# Altium schematic sheet Morpheus_bottom.SchDoc: Morpheus_bottom
size Letter; DrawnBy: D. Fusi; DocumentNumber: 3; Revision: PVT; SheetNumber: 3; SheetTotal: 3
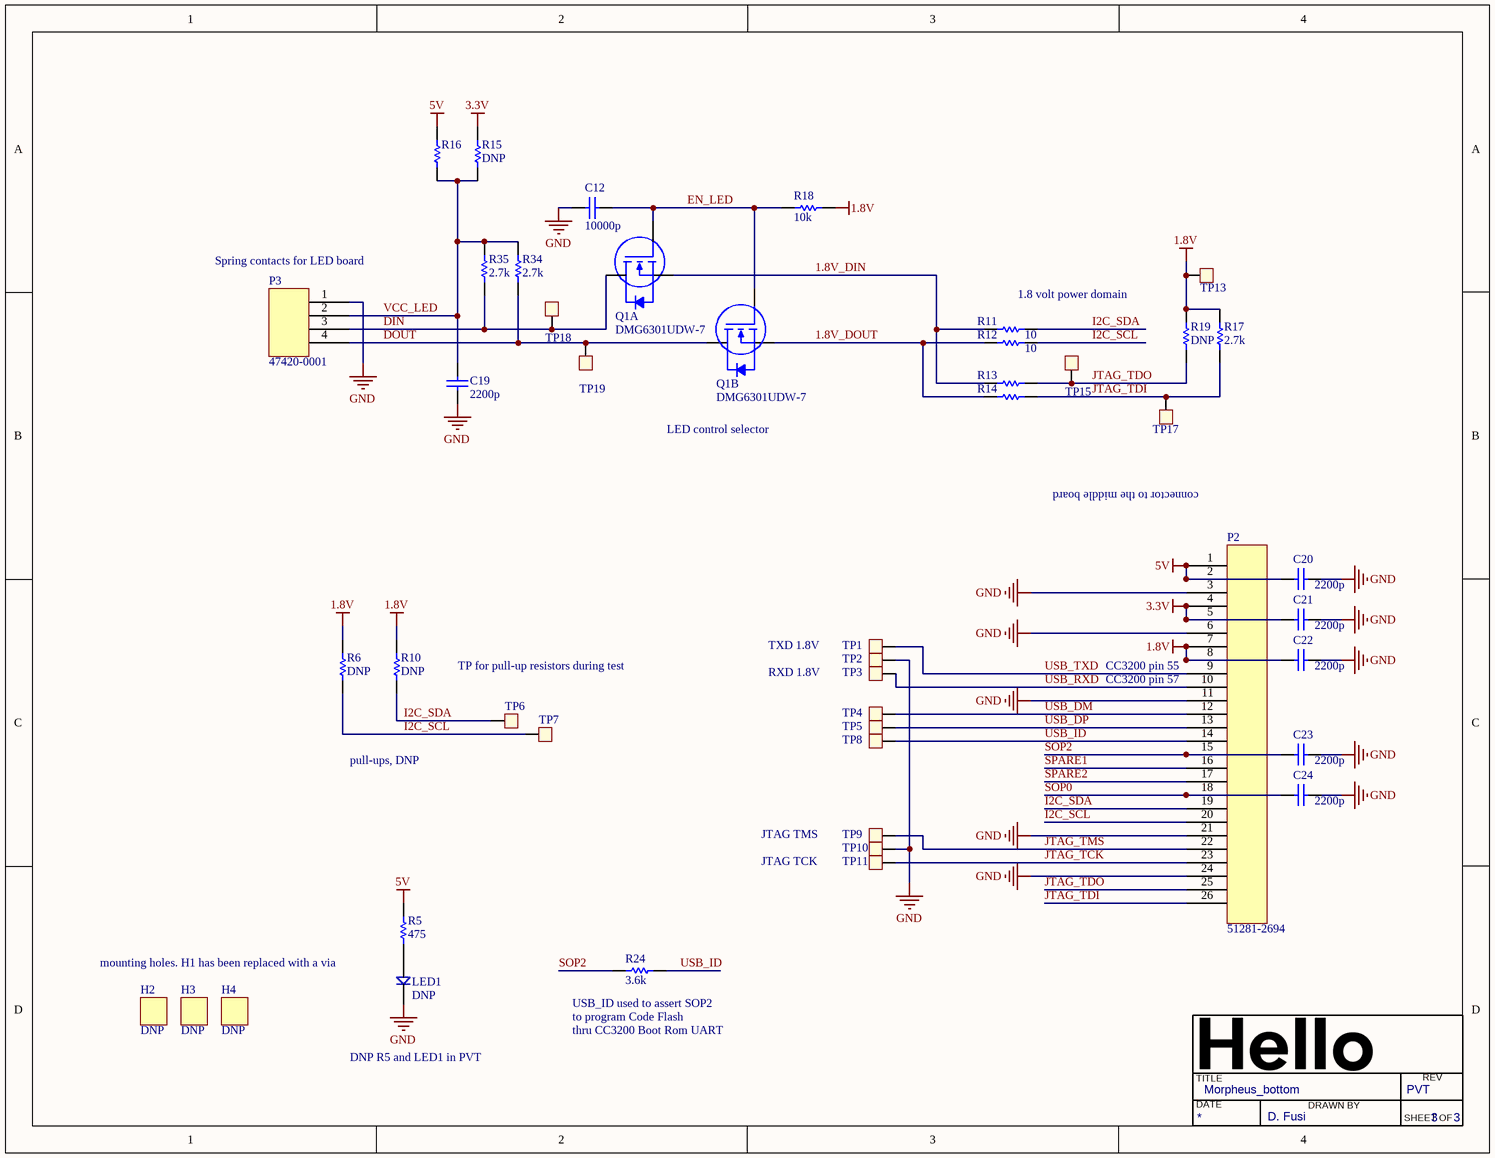
[diagram p0: Morpheus_bottom.SchDoc]

## Parts
C12  10000p  [CAP0603_SENSE_DVT]
C19  2200p  [CAP0402_SENSE_DVT]
C20  2200p  [CAP0402_SENSE_DVT]
C21  2200p  [CAP0402_SENSE_DVT]
C22  2200p  [CAP0402_SENSE_DVT]
C23  2200p  [CAP0402_SENSE_DVT]
C24  2200p  [CAP0402_SENSE_DVT]
H2  DNP  [HOLE_ROUND_1.8mm]
H3  DNP  [HOLE_ROUND_1.8mm]
H4  DNP  [HOLE_ROUND_1.8mm]
LED1  DNP  [LED_Kingbright]
P2  51281-2694  [molex_51281-2694_reverse]
P3  47420-0001  [molex_47420-0001]
Q1  DMG6301UDW-7  [SC-70-6]  (parts A,B of 2)
R5  475  [RES0402_SENSE_DVT]
R6  DNP  [RES0603_SENSE_DVT]
R10  DNP  [RES0603_SENSE_DVT]
R11  10  [RES0402_SENSE_DVT]
R12  10  [RES0402_SENSE_DVT]
R13  R_0_jumper_0.1_0402  [RES0402-SENSE-DVT]  (value not drawn)
R14  R_0_jumper_0.1_0402  [RES0402-SENSE-DVT]  (value not drawn)
R15  DNP  [RES0603_SENSE_DVT]
R16  R_0_jumper_0.1_0402  [RES0402-SENSE-DVT]  (value not drawn)
R17  2.7k  [RES0402_SENSE_DVT]
R18  10k  [RES0402_SENSE_DVT]
R19  DNP  [RES0402_SENSE_DVT]
R24  3.6k  [RES0402_SENSE_DVT]
R34  2.7k  [RES0402_SENSE_DVT]
R35  2.7k  [RES0402_SENSE_DVT]
TP1  TP  [TP-1.1]  (value not drawn)
TP2  TP  [TP-1.1]  (value not drawn)
TP3  TP  [TP-1.1]  (value not drawn)
TP4  TP  [TP-1.1]  (value not drawn)
TP5  TP  [TP-1.1]  (value not drawn)
TP6  TP  [TP-1.1]  (value not drawn)
TP7  TP  [TP-1.1]  (value not drawn)
TP8  TP  [TP-1.1]  (value not drawn)
TP9  TP  [TP-1.1]  (value not drawn)
TP10  TP  [TP-1.1]  (value not drawn)
TP11  TP  [TP-1.1]  (value not drawn)
TP13  TP  [TP-1.1]  (value not drawn)
TP15  TP  [TP-1.1]  (value not drawn)
TP17  TP  [TP-1.1]  (value not drawn)
TP18  TP  [TP-1.1]  (value not drawn)
TP19  TP  [TP-1.1]  (value not drawn)

## Nets
1.8V: C22.1 P2.7 P2.8 R6.2 R10.2 R17.2 R18.2 R19.2 TP13.1
3.3V: C21.1 P2.4 P2.5 R15.2
5V: C20.1 P2.1 P2.2 R5.2 R16.2
GND: C12.2 C19.1 C20.2 C21.2 C22.2 C23.2 C24.2 LED1.2(Cathode) P2.3 P2.6 P2.11 P2.21 P2.24 P3.1 TP2.1 TP10.1
1.8V_DIN: Q1.1(S1) R11.2 R13.1
1.8V_DOUT: Q1.4(S2) R12.2 R14.1
DIN: P3.3 Q1.6(D1) R35.1 TP18.1
DOUT: P3.4 Q1.3(D2) R34.1 TP19.1
EN_LED: C12.1 Q1.2(G1) Q1.5(G2) R18.1
I2C_SCL: P2.20 R6.1 R12.1 TP7.1
I2C_SDA: P2.19 R10.1 R11.1 TP6.1
JTAG_TCK: P2.23 TP11.1
JTAG_TDI: P2.26 R14.2 R17.1 TP17.1
JTAG_TDO: P2.25 R13.2 R19.1 TP15.1
JTAG_TMS: P2.22 TP9.1
SOP0: C24.1 P2.18
SOP2: C23.1 P2.15 R24.1
SPARE1: P2.16
SPARE2: P2.17
USB_DM: P2.12 TP4.1
USB_DP: P2.13 TP5.1
USB_ID: P2.14 R24.2 TP8.1
USB_RXD: P2.10 TP3.1
USB_TXD: P2.9 TP1.1
VCC_LED: C19.2 P3.2 R15.1 R16.1 R34.2 R35.2
NetLED1_1: LED1.1(Anode) R5.1

## Notes on the sheet
- (near P3) Spring contacts for LED board
- 1.8 volt power domain
- LED control selector
- connector to the middle board
- TP for pull-up resistors during test
- TXD 1.8V
- RXD 1.8V
- (near P2) CC3200 pin 55
- (near P2) CC3200 pin 57
- pull-ups, DNP
- JTAG TMS
- JTAG TCK
- mounting holes. H1 has been replaced with a via
- (near R24) USB_ID used to assert SOP2
- thru CC3200 Boot Rom UART
- (near R24) to program Code Flash
- DNP R5 and LED1 in PVT
- TITLE
- DATE
- DRAWN BY
- REV
- SHEET
- OF

## Library data of the parts
C12 = C_10000p_10_50_X7R_0603: CAP CER 10000PF 50V 10% X7R 0603; Vendor: Yageo; PN: CC0603KRX7R9BB103; Voltage: 50; Hello_PN: 225-00355; item_category: Capacitor; Value: 10000p; Size: 0603; Tolerance: 10%; Temp: X7R
C19-C24 = C_2200p_5_16_STD_0402: CAP CER 2200PF 16V 10% X7R 0402; Vendor: Taiyo Yuden; PN: GRM155R71C222KA01D; Temp: Standard; Hello_PN: 225-00417; item_category: Capacitor; Value: 2200p; Size: 0402; Tolerance: 10 %; Voltage: 16V
H2-H4 = Hole: general purpose hole
LED1 = APT2012SGC: Kingbright Green SMT LED
P2 = 51281-011: Molex 26-pin 0.5mm pitch connector; PN: 51281-2694; Vendor: Molex
P3 = molex_47420-0001: Molex 4-pin spring connector 1.8 mm working height; Hello_PN: 280-00273; PN: 47420-0001; Vendor: Molex; item_category: Connector
Q1 = DMG6301UDW-7: MOSFET 2N-CH 25V 240MA SOT363; Vendor: Diodes Inc.; Hello_PN: 240-00358; item_category: Transistor; PN: DMG6301UDW-7
R5 = R_475_1_0.1_0402: RES SMD 475 OHM 1% 1/16W 0402; Vendor: Yageo; Power: 0.1 W; PN: RC0402FR-07475RL; Hello_PN: 220-00456; item_category: Resistor; Model: *; Value: 475; Tolerance: 1 %; Size: 0402
R6 R10 R15 = R_2.7k_1_0.1_0603: Chip Resistor; Value: 2.7k; Vendor: Panasonic; Tolerance: 1 %; Power: 0.1 W; PN: ERJ-3EKF2701V; Model: *; Size: 0603
R11 R12 = R_10_1_0.1_0402: RES SMD 10 OHM 1% 1/16W 0402; Vendor: Yageo; PN: RC0402FR-0710RL; Hello_PN: 220-00405; item_category: Resistor; Model: *; Value: 10; Tolerance: 1 %; Power: 1/16W; Size: 0402
R13 R14 R16 = R_0_jumper_0.1_0402: RES SMD 0.0 OHM JUMPER 1/16W; Value: 0; Vendor: Yageo; PN: RC0402JR-070RL; Hello_PN: 220-00408; item_category: Resistor; Model: *; Tolerance: Jumper; Power: 1/16W; Size: 0402
R17 R19 R34 R35 = R_2.7k_5_0.1_0402: RES SMD 2.7K OHM 5% 1/16W 0402; Vendor: Yageo; PN: RC0402JR-072K7L; Hello_PN: 220-00446; Model: *; Value: 2.7k; Tolerance: 5 %; Power: 1/16W; Size: 0402
R18 = R_10k_5_0.1_0402: RES SMD 10K OHM 5% 1/16W 0402; Vendor: Yageo; PN: RC0402JR-0710KL; Hello_PN: 220-00409; item_category: Resistor; Model: *; Value: 10k; Tolerance: 5 %; Power: 1/16W; Size: 0402
R24 = R_3.6k_1_0.1_0402: RES SMD 3.6K OHM 1% 1/16W 0402; Vendor: Yageo; PN: RC0402FR-073K6L; Hello_PN: 220-00444; item_category: Resistor; Model: *; Value: 3.6k; Tolerance: 1 %; Power: 1/16W; Size: 0402
TP1-TP11 TP13 TP15 TP17-TP19 = TP: testpoint